# Altium schematic sheet OUTPUT.SchDoc
size A4; SheetNumber: 5; SheetTotal: 6
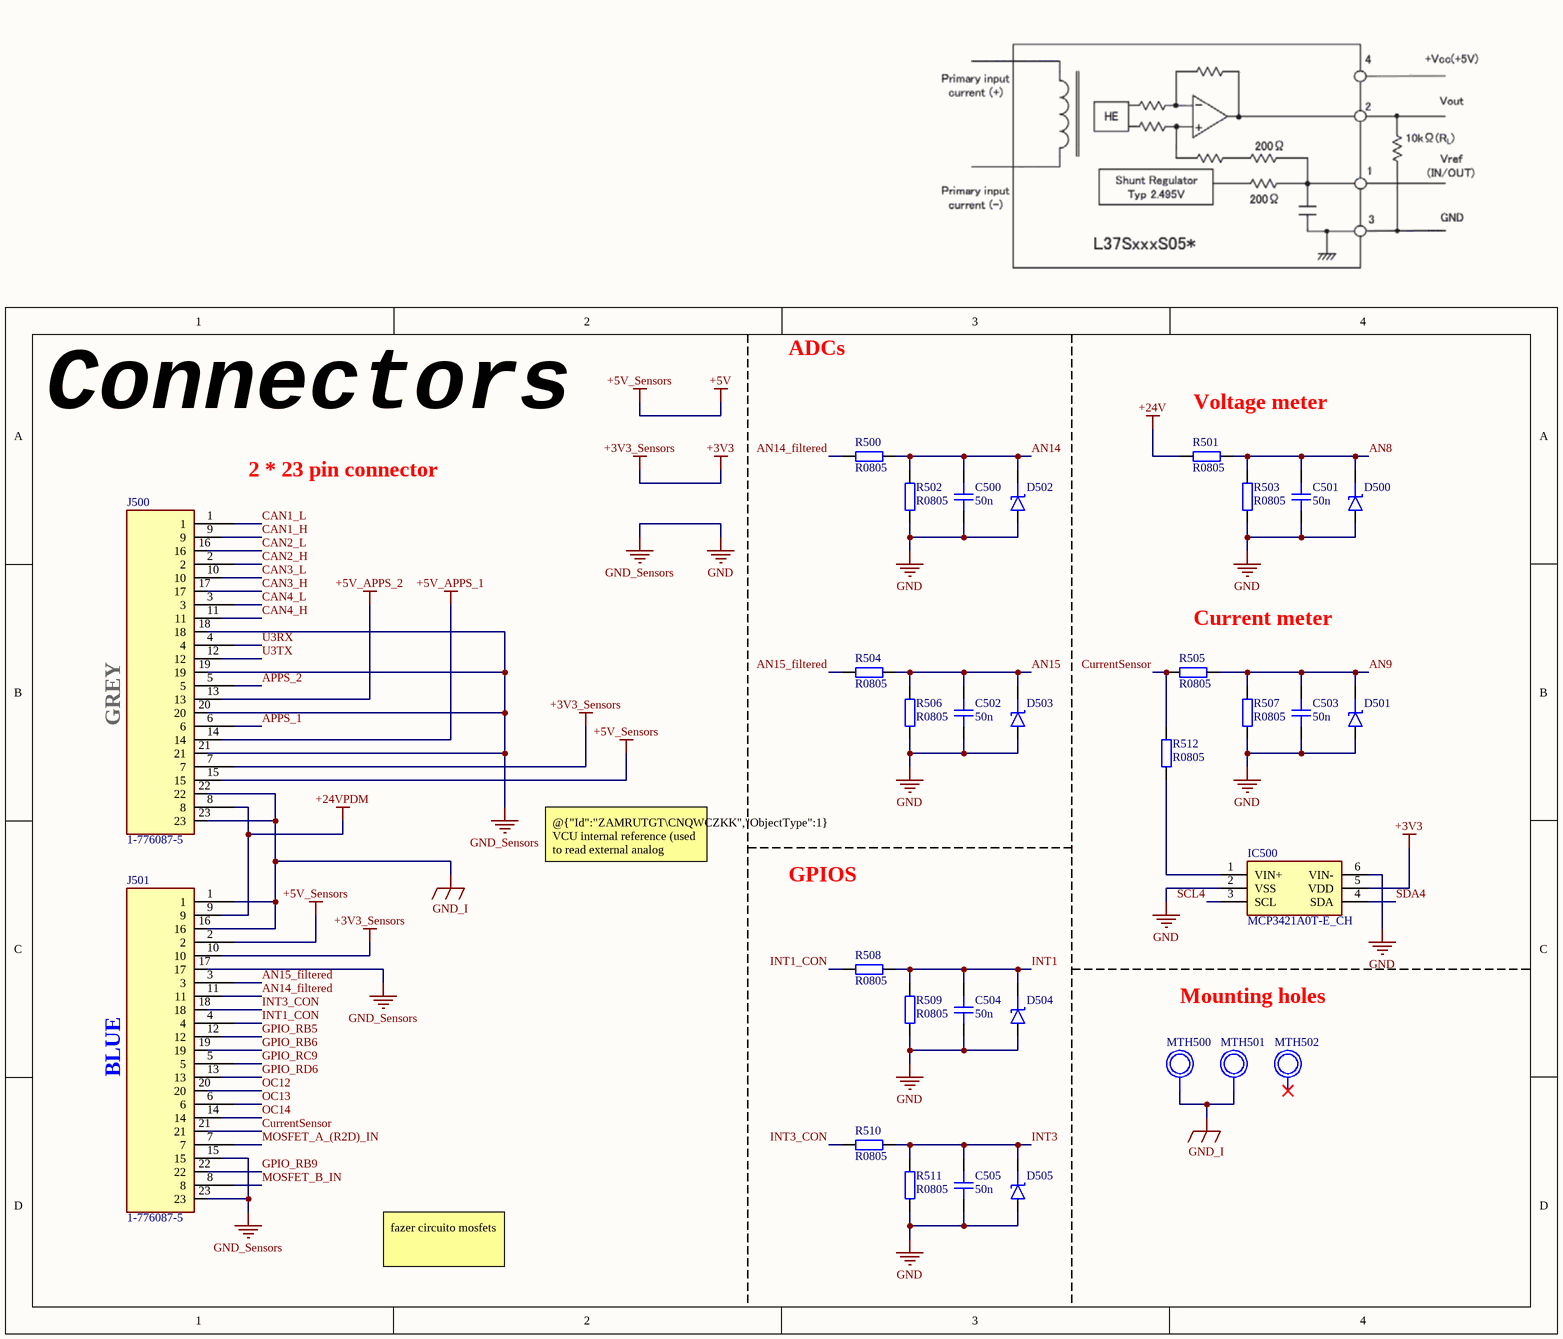
[diagram p0: OUTPUT.SchDoc]

## Parts
C500  50n  [CAP_0805]
C501  50n  [CAP_0805]
C502  50n  [CAP_0805]
C503  50n  [CAP_0805]
C504  50n  [CAP_0805]
C505  50n  [CAP_0805]
D500  D_SCHOTTKY_SOD_323  [SOD-323]  (value not drawn)
D501  D_SCHOTTKY_SOD_323  [SOD-323]  (value not drawn)
D502  D_SCHOTTKY_SOD_323  [SOD-323]  (value not drawn)
D503  D_SCHOTTKY_SOD_323  [SOD-323]  (value not drawn)
D504  D_SCHOTTKY_SOD_323  [SOD-323]  (value not drawn)
D505  D_SCHOTTKY_SOD_323  [SOD-323]  (value not drawn)
IC500  MCP3421A0T-E_CH  [SOT95P270X145-6N]
J500  1-776087-5  [1-776087-5]
J501  1-776087-5  [1-776087-5]
MTH500  Mounting_Hole_3.5mm  [Mounting_Hole_3.5mm]  (value not drawn)
MTH501  Mounting_Hole_3.5mm  [Mounting_Hole_3.5mm]  (value not drawn)
MTH502  Mounting_Hole_3.5mm  [Mounting_Hole_3.5mm]  (value not drawn)
R500  R0805  [RES_0805]
R501  R0805  [RES_0805]
R502  R0805  [RES_0805]
R503  R0805  [RES_0805]
R504  R0805  [RES_0805]
R505  R0805  [RES_0805]
R506  R0805  [RES_0805]
R507  R0805  [RES_0805]
R508  R0805  [RES_0805]
R509  R0805  [RES_0805]
R510  R0805  [RES_0805]
R511  R0805  [RES_0805]
R512  R0805  [RES_0805]

## Nets
+3V3: IC500.5(VDD) J500.7 J501.10  [also labelled +3V3_Sensors]
+5V: J500.15 J501.2  [also labelled +5V_Sensors]
+5V_APPS_1: J500.14
+5V_APPS_2: J500.13
+24V: R501.2
+24VPDM: J500.8 J501.9
GND: C500.2 C501.2 C502.2 C503.2 C504.2 C505.2 D500.A D501.A D502.A D503.A D504.A D505.A IC500.2(VSS) IC500.6(VIN-) J500.18 J500.19 J500.20 J500.21 J501.15 J501.17 J501.23 R502.2 R503.2 R506.2 R507.2 R509.2 R511.2  [also labelled GND_Sensors]
GND_I: J500.22 J500.23 J501.1 J501.16 MTH500.1 MTH501.1
AN8: C501.1 D500.K R501.1 R503.1
AN9: C503.1 D501.K R505.1 R507.1
AN14: C500.1 D502.K R500.1 R502.1
AN14_filtered: J501.11 R500.2
AN15: C502.1 D503.K R504.1 R506.1
AN15_filtered: J501.3 R504.2
APPS_1: J500.6
APPS_2: J500.5
CAN1_H: J500.9
CAN1_L: J500.1
CAN2_H: J500.2
CAN2_L: J500.16
CAN3_H: J500.17
CAN3_L: J500.10
CAN4_H: J500.11
CAN4_L: J500.3
CurrentSensor: J501.21 R505.2 R512.1
GPIO_RB5: J501.12
GPIO_RB6: J501.19
GPIO_RB9: J501.22
GPIO_RC9: J501.5
GPIO_RD6: J501.13
INT1: C504.1 D504.K R508.1 R509.1
INT1_CON: J501.4 R508.2
INT3: C505.1 D505.K R510.1 R511.1
INT3_CON: J501.18 R510.2
MOSFET_A_(R2D)_IN: J501.7
MOSFET_B_IN: J501.8
OC12: J501.20
OC13: J501.6
OC14: J501.14
SCL4: IC500.3(SCL)
SDA4: IC500.4(SDA)
U3RX: J500.4
U3TX: J500.12
NetIC500_1: IC500.1(VIN+) R512.2

Not connected (* = marked no-connect by the designer): MTH502 1*

## Notes on the sheet
- ADCs
- (near R501) Voltage meter
- Connectors
- 2 * 23 pin connector
- (near R505) Current meter
- GREY
- @{"Id":"ZAMRUTGT\CNQWCZKK","ObjectType":1} VCU internal reference (used to read external analog sensores)
- GPIOS
- Mounting holes
- BLUE
- fazer circuito mosfets

## Library data of the parts
C500-C505 = CAP_0805_10V: Capacitor SMD 0805 10V
D500-D505 = D_SCHOTTKY_SOD_323: Diode Schottky SMD SOD-323
IC500 = MCP3421A0T-E_CH: Integrated Circuit; Manufacturer_Name: Microchip; Manufacturer_Part_Number: MCP3421A0T-E/CH; Datasheet Link: http://ww1.microchip.com/downloads/en/DeviceDoc/22003e.pdf; Height: 1.45mm; Mouser Part Number: 579-MCP3421A0T-E/CH; Mouser Price/Stock: https://www.mouser.co.uk/ProductDetail/Microchip-Technology/MCP3421A0T-E-CH?qs=hH%252BOa0VZEiAAD%252B%252BQL9ANdQ%3D%3D; Arrow Part Number: MCP3421A0T-E/CH; Arrow Price/Stock: https://www.arrow.com/en/products/mcp3421a0t-ech/microchip-technology?region=nac
J500 J501 = 1-776087-5: CONN HDR 23POS R/A W/GASKET AU
R500-R512 = RES_0805: Resistor SMD 0805; Manufacturer: *; Manufacturer Part Number: *; Distributor Link: *; LCSC: *